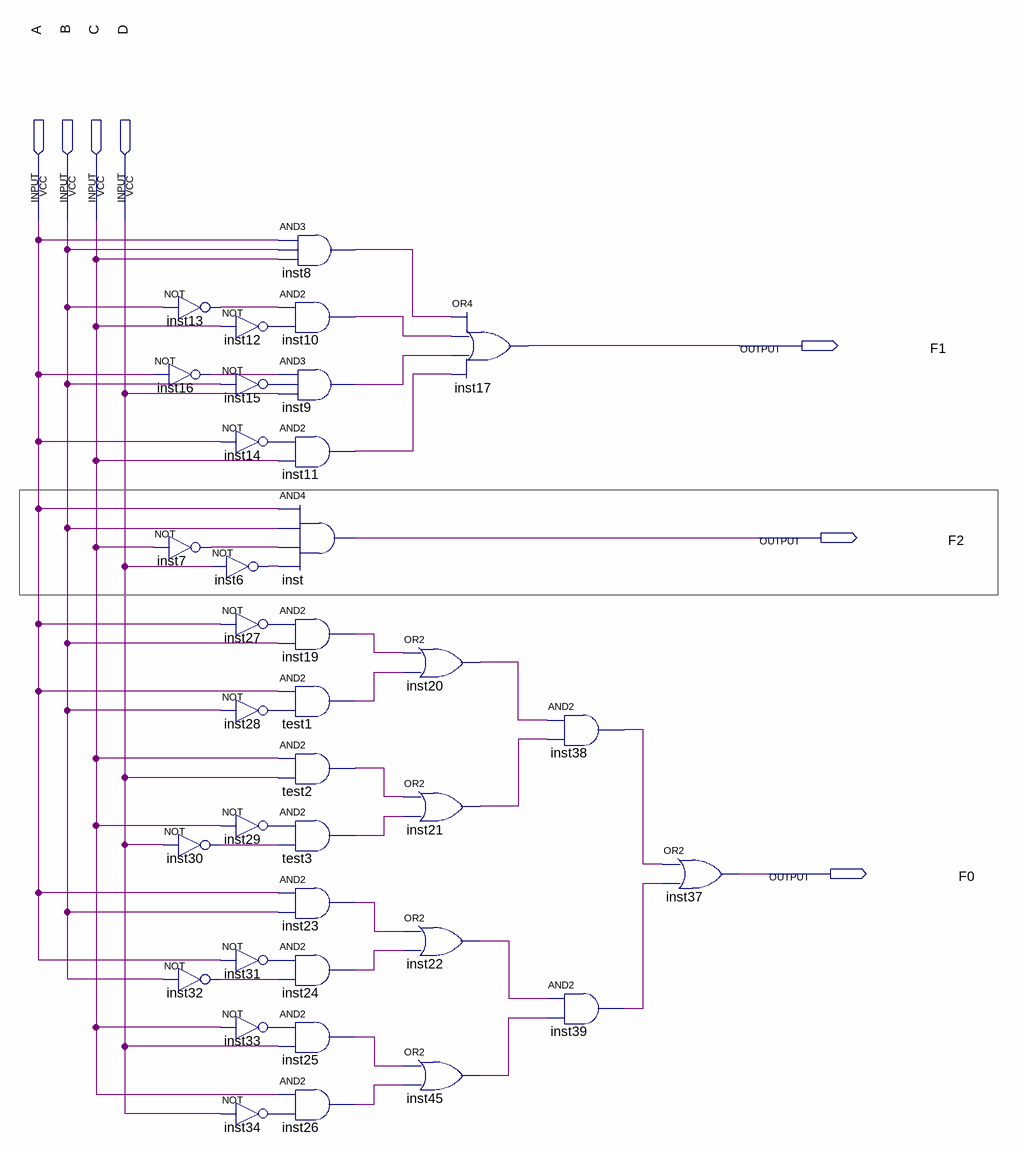
[diagram p0: schematic sheet]
// Quartus schematic lab3_p1.bdf as structural Verilog: 36 symbols, 7 pins
module lab3_p1 (
  input  A,
  input  B,
  input  C,
  input  D,
  output F1,
  output F2,
  output F0
);

  wire inst6_out, inst7_out, inst8_out, inst9_out, inst10_out, inst11_out, inst12_out, inst13_out,
       inst14_out, inst15_out, inst16_out, inst19_out, inst20_out, inst21_out, inst22_out, inst23_out,
       inst24_out, inst25_out, inst26_out, inst27_out, inst28_out, inst29_out, inst30_out, inst31_out,
       inst32_out, inst33_out, inst34_out, inst38_out, inst39_out, inst45_out, test1_out, test2_out,
       test3_out;

  not inst13 (inst13_out, B);
  not inst12 (inst12_out, C);
  not inst16 (inst16_out, A);
  not inst15 (inst15_out, B);
  not inst14 (inst14_out, A);
  not inst7 (inst7_out, C);
  not inst6 (inst6_out, D);
  not inst27 (inst27_out, A);
  not inst28 (inst28_out, B);
  not inst29 (inst29_out, C);
  not inst30 (inst30_out, D);
  not inst31 (inst31_out, A);
  not inst32 (inst32_out, B);
  not inst33 (inst33_out, C);
  not inst34 (inst34_out, D);
  and inst8 (inst8_out, A, B, C);
  and inst10 (inst10_out, inst13_out, inst12_out);
  and inst9 (inst9_out, inst16_out, inst15_out, D);
  and inst11 (inst11_out, inst14_out, C);
  and inst (F2, A, B, inst7_out, inst6_out);
  and inst19 (inst19_out, inst27_out, B);
  and test1 (test1_out, A, inst28_out);
  and test2 (test2_out, C, D);
  and test3 (test3_out, inst29_out, inst30_out);
  and inst23 (inst23_out, A, B);
  and inst24 (inst24_out, inst31_out, inst32_out);
  and inst25 (inst25_out, inst33_out, D);
  and inst26 (inst26_out, C, inst34_out);
  or inst17 (F1, inst8_out, inst10_out, inst9_out, inst11_out);
  or inst20 (inst20_out, inst19_out, test1_out);
  or inst21 (inst21_out, test2_out, test3_out);
  or inst22 (inst22_out, inst23_out, inst24_out);
  or inst45 (inst45_out, inst25_out, inst26_out);
  and inst38 (inst38_out, inst20_out, inst21_out);
  and inst39 (inst39_out, inst22_out, inst45_out);
  or inst37 (F0, inst38_out, inst39_out);
endmodule
